# EAGLE board schemat_sterownik_dachu_R129_wersjaD09_Dr_03 (EAGLE 7.5.0)
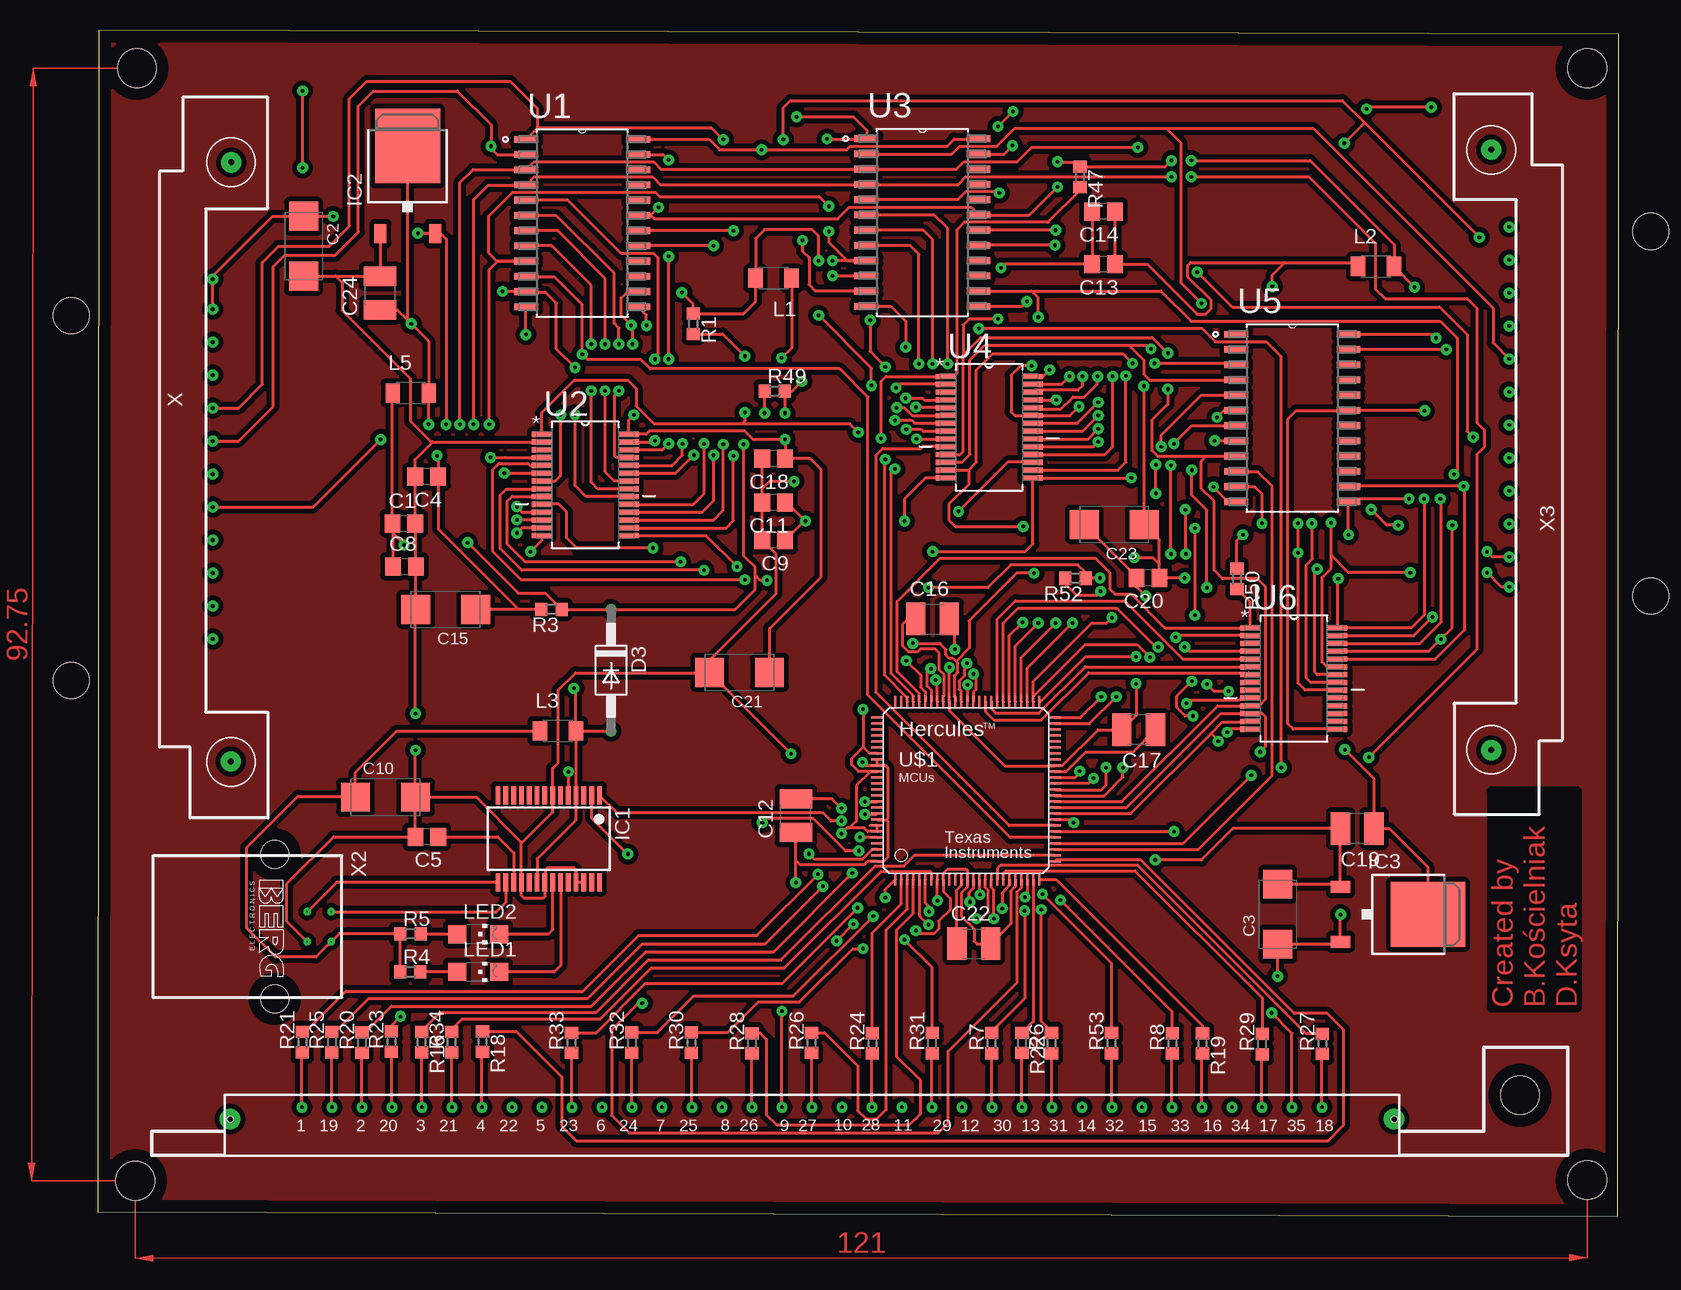
[diagram p1: board, top side]
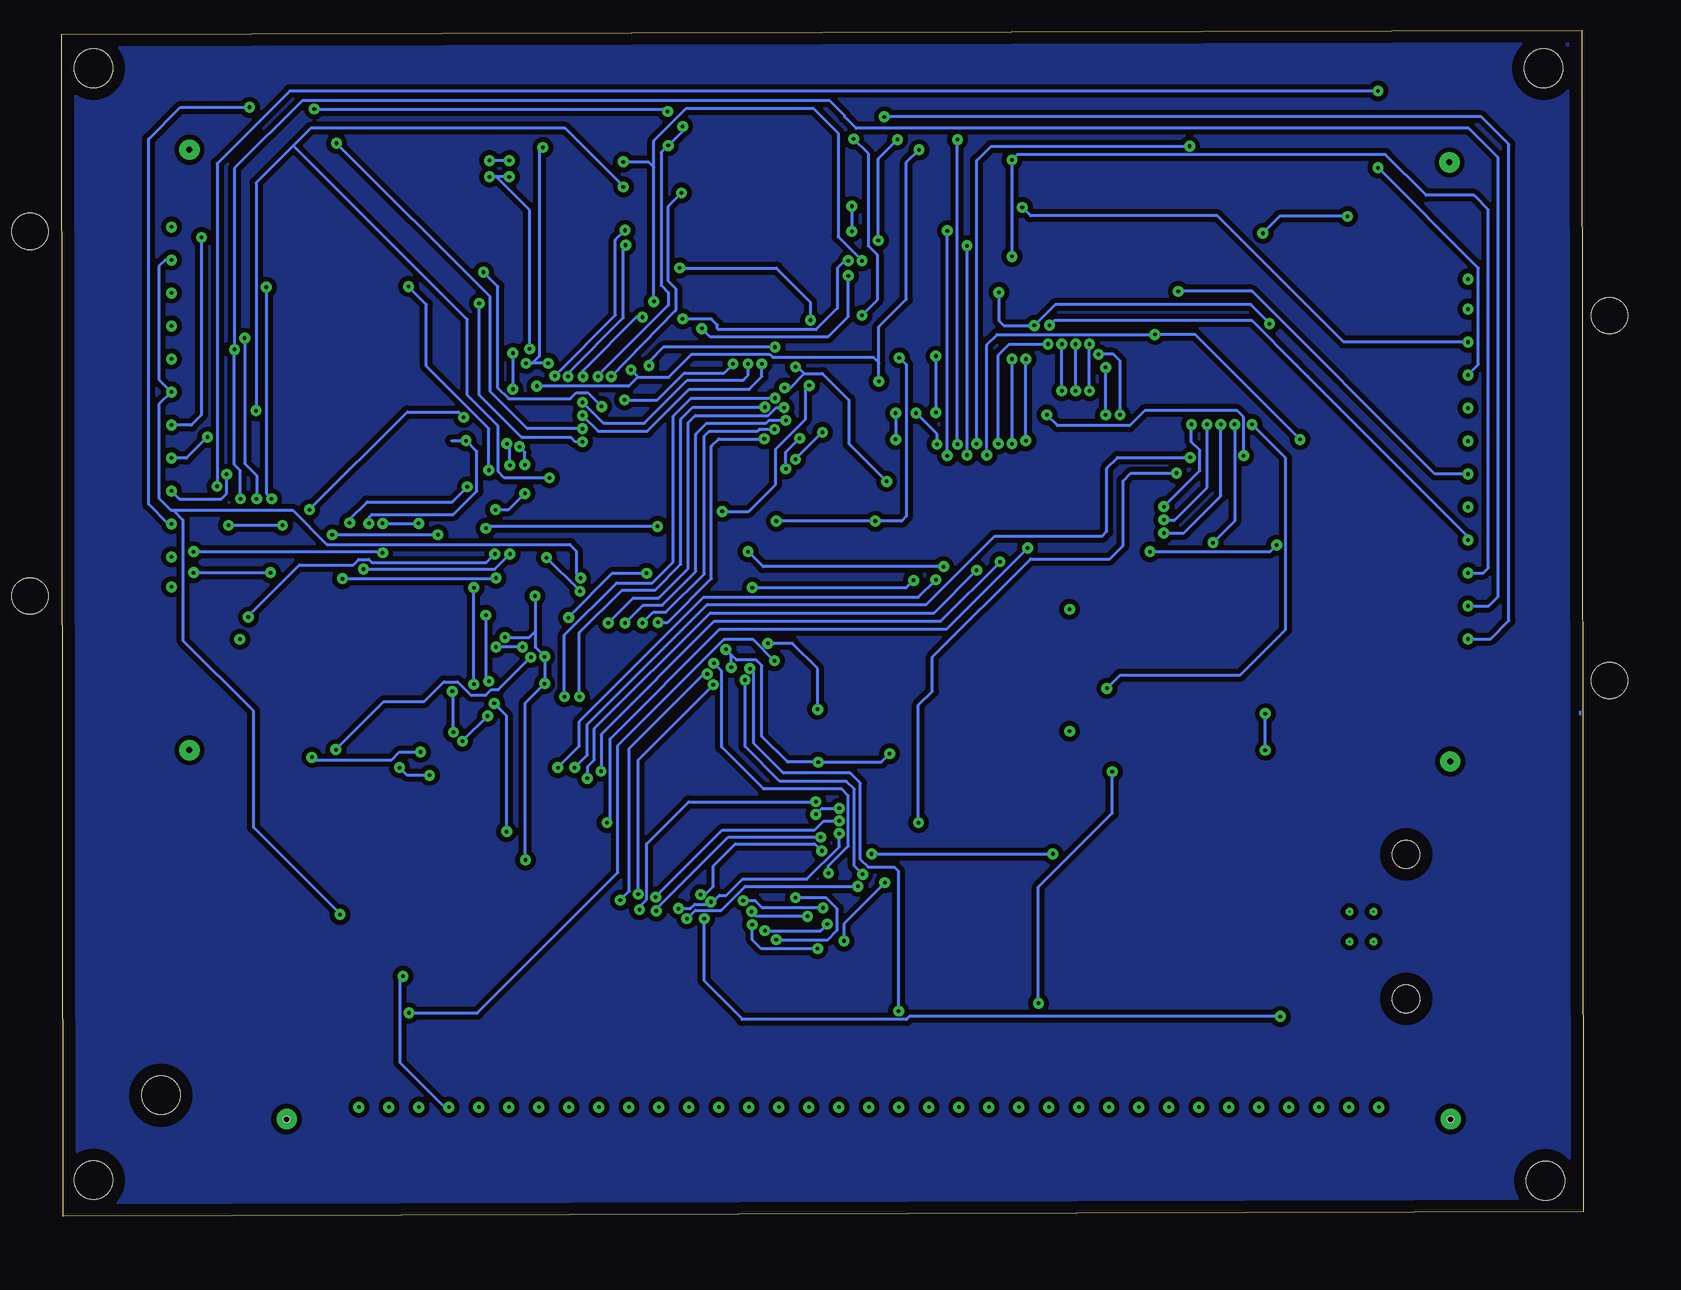
[diagram p2: board, bottom side, seen from below]

Size 126.78 x 98.89 mm. Coordinates in mm from the lower left corner, seen from the top.
Outline: 0,0.35 126.68,0 126.78,98.54 0.1,98.89 0,0.35
Copper layers (1+16): Top 0.035mm / dielectric 1.5mm / Bottom 0.035mm
Design rules "default *": minimum track width 0.2mm, minimum drill 24mil, track to track 8mil, track to pad 8mil, pad to pad 8mil, via to via 8mil, smd to smd 8mil, copper to edge 40mil, drill to drill 8mil, minimum pad ring 10mil, minimum via ring 8mil, stop-mask expansion 4mil, vias tented up to drill 0mil, thermal gap 10mil
Net classes: 0 default: clearance 0.205 mm
Holes 3.2 mm at 3.29,95.7 3.14,2.95 124.14,3 124.14,95.7

## Footprints (pad centres in the part's own frame; a part is rotated, then mirrored left to right if it is on the bottom)
C0805 = smd 1.3 x 1.5: 1 -0.95,0; 2 0.95,0
SMC_C = smd 2.4 x 2.4: + -2.5,0; - 2.5,0
C3225 = smd 1.6 x 2.7: 1 -1.4,0; 2 1.4,0
C1210 = smd 1.6 x 2.7: 1 -1.4,0; 2 1.4,0
DO41-10 = drill 0.3 pad 0.9: A 5.08,0; C -5.08,0
SSOP28 = smd 0.4 x 1.5: 1 -4.225,-3.625; 2 -3.575,-3.625; 3 -2.925,-3.625; 4 -2.275,-3.625; 5 -1.625,-3.625; 6 -0.975,-3.625; 7 -0.325,-3.625; 8 0.325,-3.625; 9 0.975,-3.625; 10 1.625,-3.625; 11 2.275,-3.625; 12 2.925,-3.625; 13 3.575,-3.625; 14 4.225,-3.625; 15 4.225,3.625; 16 3.575,3.625; 17 2.925,3.625; 18 2.275,3.625; 19 1.625,3.625; 20 0.975,3.625; 21 0.325,3.625; 22 -0.325,3.625; 23 -0.975,3.625; 24 -1.625,3.625; 25 -2.275,3.625; 26 -2.925,3.625; 27 -3.575,3.625; 28 -4.225,3.625
TO252 = smd 1 x 1.6: 1 -2.28,-4.8; 2 2.28,-4.8 | smd 5.4 x 6.2: TAB 0,2.5
L3216C = smd 1.2 x 1.6: 1 -1.5,0; 2 1.5,0
CHIPLED_1206 = smd 1.5 x 1.5: A 0,-1.75; C 0,1.75
R0603 = smd 1 x 1.1: 1 -0.85,0; 2 0.85,0
SOIC127P1030X265-24N = smd 1.981 x 0.559: 1 -4.674,6.985; 2 -4.674,5.715; 3 -4.674,4.445; 4 -4.674,3.175; 5 -4.674,1.905; 6 -4.674,0.635; 7 -4.674,-0.635; 8 -4.674,-1.905; 9 -4.674,-3.175; 10 -4.674,-4.445; 11 -4.674,-5.715; 12 -4.674,-6.985; 13 4.674,-6.985; 14 4.674,-5.715; 15 4.674,-4.445; 16 4.674,-3.175; 17 4.674,-1.905; 18 4.674,-0.635; 19 4.674,0.635; 20 4.674,1.905; 21 4.674,3.175; 22 4.674,4.445; 23 4.674,5.715; 24 4.674,6.985
SOP65P780X200-28N = smd 1.651 x 0.432: 1 -3.632,4.216; 2 -3.632,3.581; 3 -3.632,2.921; 4 -3.632,2.286; 5 -3.632,1.626; 6 -3.632,0.965; 7 -3.632,0.33; 8 -3.632,-0.33; 9 -3.632,-0.965; 10 -3.632,-1.626; 11 -3.632,-2.286; 12 -3.632,-2.921; 13 -3.632,-3.581; 14 -3.632,-4.216; 15 3.632,-4.216; 16 3.632,-3.581; 17 3.632,-2.921; 18 3.632,-2.286; 19 3.632,-1.626; 20 3.632,-0.965; 21 3.632,-0.33; 22 3.632,0.33; 23 3.632,0.965; 24 3.632,1.626; 25 3.632,2.286; 26 3.632,2.921; 27 3.632,3.581; 28 3.632,4.216
S-PQFP-G100 = smd 0.17 x 1: P$1 1,-0.5; P$2 1.5,-0.5; P$3 2,-0.5; P$4 2.5,-0.5; P$5 3,-0.5; P$6 3.5,-0.5; P$7 4,-0.5; P$8 4.5,-0.5; P$9 5,-0.5; P$10 5.5,-0.5; P$11 6,-0.5; P$12 6.5,-0.5; P$13 7,-0.5; P$14 7.5,-0.5; P$15 8,-0.5; P$16 8.5,-0.5; P$17 9,-0.5; P$18 9.5,-0.5; P$19 10,-0.5; P$20 10.5,-0.5; P$21 11,-0.5; P$22 11.5,-0.5; P$23 12,-0.5; P$24 12.5,-0.5; P$25 13,-0.5; P$51 13,14.3; P$52 12.5,14.3; P$53 12,14.3; P$54 11.5,14.3; P$55 11,14.3; P$56 10.5,14.3; P$57 10,14.3; P$58 9.5,14.3; P$59 9,14.3; P$60 8.5,14.3; P$61 8,14.3; P$62 7.5,14.3; P$63 7,14.3; P$64 6.5,14.3; P$65 6,14.3; P$66 5.5,14.3; P$67 5,14.3; P$68 4.5,14.3; P$69 4,14.3; P$70 3.5,14.3; P$71 3,14.3; P$72 2.5,14.3; P$73 2,14.3; P$74 1.5,14.3; P$75 1,14.3 | smd 1 x 0.17: P$26 14.3,1; P$27 14.3,1.5; P$28 14.3,2; P$29 14.3,2.5; P$30 14.3,3; P$31 14.3,3.5; P$32 14.3,4; P$33 14.3,4.5; P$34 14.3,5; P$35 14.3,5.5; P$36 14.3,6; P$37 14.3,6.5; P$38 14.3,7; P$39 14.3,7.5; P$40 14.3,8; P$41 14.3,8.5; P$42 14.3,9; P$43 14.3,9.5; P$44 14.3,10; P$45 14.3,10.5; P$46 14.3,11; P$47 14.3,11.5; P$48 14.3,12; P$49 14.3,12.5; P$50 14.3,13; P$76 -0.5,13; P$77 -0.5,12.5; P$78 -0.5,12; P$79 -0.5,11.5; P$80 -0.5,11; P$81 -0.5,10.5; P$82 -0.5,10; P$83 -0.5,9.5; P$84 -0.5,9; P$85 -0.5,8.5; P$86 -0.5,8; P$87 -0.5,7.5; P$88 -0.5,7; P$89 -0.5,6.5; P$90 -0.5,6; P$91 -0.5,5.5; P$92 -0.5,5; P$93 -0.5,4.5; P$94 -0.5,4; P$95 -0.5,3.5; P$96 -0.5,3; P$97 -0.5,2.5; P$98 -0.5,2; P$99 -0.5,1.5; P$100 -0.5,1
5566-12 = drill 0.3 pad 0.9: 1 -11.75,-9.5; 2 -9,-9.5; 3 -6.25,-9.5; 4 -3.5,-9.5; 5 -0.75,-9.5; 6 2,-9.5; 7 4.75,-9.5; 8 7.5,-9.5; 9 10.25,-9.5; 10 13,-9.5; 11 15.75,-9.5; 12 18.25,-9.5 | hole 3: 15.2,2.29; -15.2,2.29
PN61729 = drill 0.1 octagon: 1 1.25,4.71; 2 -1.25,4.71; 3 -1.25,2.71; 4 1.25,2.71 | hole 2.3: -6.02,0; 6.02,0
5566-12' = drill 0.3 pad 0.9: 1 14.44,-9.5; 2 11.94,-9.5; 3 9.19,-9.5; 4 6.44,-9.5; 5 3.69,-9.5; 6 0.94,-9.5; 7 -1.81,-9.5; 8 -4.56,-9.5; 9 -7.31,-9.5; 10 -10.06,-9.5; 11 -12.81,-9.5; 12 -15.56,-9.5 | hole 3: 15.2,2.29; -15.2,2.29
5749069-4 = drill 0.3 pad 0.9: 1 12.59,3.888; 2 17.59,3.888; 3 22.59,3.888; 4 27.59,3.888; 5 32.59,3.888; 6 37.59,3.888; 7 42.59,3.888; 8 47.59,3.888; 9 52.59,3.888; 10 57.59,3.888; 11 62.59,3.888; 12 67.59,3.888; 13 72.59,3.888; 14 77.59,3.888; 15 82.59,3.888; 16 87.59,3.888; 17 92.59,3.888; 18 97.59,3.888; 19 15.09,3.888; 20 20.09,3.888; 21 25.09,3.888; 22 30.09,3.888; 23 35.09,3.888; 24 40.09,3.888; 25 45.09,3.888; 26 50.09,3.888; 27 55.09,3.888; 28 60.09,3.888; 29 65.09,3.888; 30 70.09,3.888; 31 75.09,3.888; 32 80.09,3.888; 33 85.09,3.888; 34 90.09,3.888; 35 95.09,3.888 | hole 3.2: 114.09,4.888 | hole 0.5: 103.61,2.89; 6.61,2.89

## Placement (x,y rotation side)
C1  0.1 uF  [C0805]  25.52,57.76 0 top
C2  10uF  [SMC_C]  17.17,80.87 270 top
C3  10uF  [SMC_C]  98.35,25.19 90 top
C4  0.1 uF  [C0805]  27.42,61.65 180 top
C5  0.1 uF  [C0805]  27.44,31.64 180 top
C8  10 uF  [C0805]  25.57,54.17 0 top
C9  10 uF  [C0805]  56.34,56.35 180 top
C10  33uF  [SMC_C]  23.99,34.94 0 top
C11  0.1 uF  [C0805]  56.34,59.5 180 top
C12  120 uF  [C3225]  58.19,33.39 90 top
C13  10 uF  [C0805]  83.82,79.35 180 top
C14  0.1 uF  [C0805]  83.82,83.76 180 top
C15  10uF  [SMC_C]  29.01,50.59 180 top
C16  120 uF  [C3225]  69.58,49.79 0 top
C17  120 uF  [C3225]  86.76,40.56 180 top
C18  0.1 uF  [C0805]  56.34,63.15 180 top
C19  100uF  [C1210]  104.97,32.32 180 top
C20  0.1 uF  [C0805]  87.54,53.21 180 top
C21  10uF  [SMC_C]  53.5,45.34 180 top
C22  120 uF  [C3225]  73.02,22.72 0 top
C23  10uF  [SMC_C]  84.72,57.67 180 top
C24  100uF  [C1210]  23.55,76.95 90 top
D3  1N4004  [DO41-10]  42.79,45.51 270 top
IC1  FT232RL  [SSOP28]  37.6,31.46 180 top
IC2  LM1117DTX-5.0  [TO252]  25.84,86.71 0 top
IC3  LM1117DTX-3.3  [TO252]  108.37,25.16 270 top
L1  600 Ohm  [L3216C]  56.33,78.19 180 top
L2  600 Ohm  [L3216C]  106.54,79.18 0 top
L3  600 Ohm  [L3216C]  38.36,40.46 0 top
L5  600 Ohm  [L3216C]  26.1,68.63 0 top
LED1  [CHIPLED_1206]  31.71,20.37 270 top
LED2  [CHIPLED_1206]  31.71,23.51 270 top
R1  10 kOhm  [R0603]  49.64,74.4 270 top
R3  12 Ohm  [R0603]  37.82,50.59 180 top
R4  270 Ohm  [R0603]  26.06,20.37 0 top
R5  270 Ohm  [R0603]  26.07,23.54 0 top
R6  10 kOhm  [R0603]  79.49,14.42 90 top
R7  10 kOhm  [R0603]  74.51,14.42 90 top
R8  10 kOhm  [R0603]  89.56,14.41 90 top
R16  4,7 kOhm  [R0603]  27.01,14.51 270 top
R18  4,7 kOhm  [R0603]  32.07,14.57 270 top
R19  10 kOhm  [R0603]  92.08,14.41 270 top
R20  10 kOhm  [R0603]  22.04,14.48 90 top
R21  10 kOhm  [R0603]  17.06,14.5 90 top
R22  10 kOhm  [R0603]  77.04,14.45 270 top
R23  10 kOhm  [R0603]  24.48,14.55 90 top
R24  10 kOhm  [R0603]  64.56,14.41 90 top
R25  10 kOhm  [R0603]  19.52,14.51 90 top
R26  10 kOhm  [R0603]  59.5,14.45 90 top
R27  10 kOhm  [R0603]  102.06,14.37 90 top
R28  10 kOhm  [R0603]  54.54,14.41 90 top
R29  10 kOhm  [R0603]  97.05,14.36 90 top
R30  10 kOhm  [R0603]  49.48,14.47 90 top
R31  10 kOhm  [R0603]  69.55,14.42 90 top
R32  10 kOhm  [R0603]  44.52,14.47 90 top
R33  10 kOhm  [R0603]  39.5,14.45 90 top
R34  10 kOhm  [R0603]  29.51,14.51 90 top
R47  10 kOhm  [R0603]  81.87,86.65 270 top
R49  12 Ohm  [R0603]  56.43,68.78 0 top
R50  10 kOhm  [R0603]  94.95,53.15 270 top
R52  12 Ohm  [R0603]  81.48,53.18 180 top
R53  10 kOhm  [R0603]  84.5,14.42 90 top
U1  TPIC2603DW  [SOIC127P1030X265-24N]  40.39,82.79 0 top
U2  TPIC46L03DB  [SOP65P780X200-28N]  40.64,60.97 0 top
U3  TPIC2603DW  [SOIC127P1030X265-24N]  68.74,82.84 0 top
U4  TPIC46L03DB  [SOP65P780X200-28N]  74.29,65.77 0 top
U5  TPIC2603DW  [SOIC127P1030X265-24N]  99.57,66.54 0 top
U6  TPIC46L03DB  [SOP65P780X200-28N]  99.7,44.82 0 top
U$1  TMS470MF03107  [S-PQFP-G100]  65.48,28.57 0 top
X  5566-12CONECTOR  [5566-12]  0.1,59.87 90 top
X2  [PN61729]  14.76,24.14 270 top
X3  5566-12CONECTOR_Z  [5566-12']  127.14,66.9 270 top
Y1  5749069-45749069-3  [5749069-4]  4.44,5.2 0 top

## Tracks (layer width: path | path; a pad name or v marks a point on that pad's centre or on a via)
3.3V  (via drill 0.3 pad 0.9)
  Top 0.254: U$1.P$20 75.98,27.59 75.39,26.9 v75.39,25.65 | U$1.P$14 72.98,27.34 72.59,26.95 72.59,26.3 v72.69,26.2 | 62.64,32.35 63.89,32.35 64.17,32.07 U$1.P$95 U$1.P$94 64.37,32.57 | 62.64,32.35 62.44,32.35 v61.99,31.9 | U$1.P$85 64.96,37.05 64.39,37.05 63.24,35.9 63.24,32.95 62.64,32.35 | U$1.P$85 64.37,37.07 | v67.94,47.75 70.19,47.75 70.69,47.25 70.69,46.8 70.99,46.5 71.29,46.5 71.54,46.25 | U$1.P$65 71.48,43.26 71.39,43.35 71.39,45.05 71.69,45.35 71.69,46.1 71.54,46.25 | v87.69,46.6 86.64,47.65 82.29,47.65 77.98,43.34 U$1.P$52 77.98,44.59 82.84,49.45 84.09,49.45 v84.54,49.9 | v63.79,42.25 63.79,39.1 | 63.79,39.1 64.29,38.6 64.95,38.6 U$1.P$82 | U$1.P$85 63.42,37.07 62.84,37.65 62.84,38.15 63.79,39.1 | v78.04,53.6 76.59,53.6 72.64,49.65 72.64,47.35 71.54,46.25 | v103.94,38.9 106.34,36.5 106.34,32.35 C19.1 107.62,32.32 110.84,29.1 110.84,25.19 IC3.TAB
  Bottom 0.254: v75.39,25.65 74.39,25.65 74.04,26 72.89,26 v72.69,26.2 72.49,26.2 71.99,26.75 71.39,26.75 70.04,28.1 64.69,28.1 61.99,30.8 v61.99,31.9 | v63.79,42.25 63.79,45.65 65.89,47.75 v67.94,47.75 | v87.69,46.6 90.39,43.9 90.99,43.9 91.44,43.45 92.69,43.45 93.79,44.55 94.94,44.55 96.59,42.9 99.94,42.9 v103.94,38.9 | v84.54,49.9 84.54,49.95 80.89,53.6 v78.04,53.6
5V  (via drill 0.3 pad 0.9)
  Top 0.254: IC1.20 36.62,28.59 36.64,28.6 36.64,29.8 39.84,33 39.84,35.05 IC1.4 39.88,40.45 L3.2 | L3.2 42.76,40.46 D3.A | IC2.TAB 25.79,88.6 25.79,74.75 | 25.79,74.75 24.99,75.55 C24.1 | 25.79,74.75 v26.14,74.4 27.59,72.95 L5.2 v27.59,66 | L3.2 39.86,43.83 v39.69,44 | v48.69,77 49.64,76.05 R1.1 53.84,75.25 54.84,76.25 L1.2 54.84,81.5 55.59,82.25 59.54,82.25 60.09,81.7 v60.09,79.65 | v45.74,74.25 45.74,75.13 U1.13 | U3.13 77.05,75.86 v77.44,76.25 | v79.99,87.9 80.01,87.88 81.49,87.88 R47.1 88.99,87.5 v89.49,88 | v91.14,88 101.04,88 108.04,81 L2.2 108.04,79.15 v109.74,77.45 | R50.1 94.95,56.31 v95.44,56.8 | v104.24,56.8 U5.13 104.49,59.8 v109.29,59.8
  Bottom 0.254: v39.69,44 38.59,45.1 28.59,45.1 24.79,48.9 24.79,63.2 v27.59,66 | v48.69,77 48.69,74.65 48.29,74.25 v45.74,74.25 43.99,76 27.69,76 26.14,74.45 v26.14,74.4 | v77.44,76.25 77.44,87.45 | 77.44,87.45 77.44,89.65 74.74,92.35 64.14,92.35 62.09,90.3 62.09,81.65 v60.09,79.65 | v79.99,87.9 77.89,87.9 77.44,87.45 | v89.49,88 v91.14,88 | v95.44,56.8 v104.24,56.8 | v109.74,77.45 109.74,60.25 v109.29,59.8
ADIN[2]
  Top 0.254: U$1.P$71 68.48,43.56 66.64,45.4 66.64,51.25 70.24,54.85 83.14,54.85 84.34,53.65 84.34,52.3 84.79,51.85 86.14,51.85 88.94,49.05 96.05,49.05 U6.1 96.07,51.18 R50.2
ADIN[3]  (via drill 0.3 pad 0.9)
  Top 0.254: U$1.P$72 67.98,43.41 66.14,45.25 66.14,62 v66.44,62.3 | v65.29,64.85 65.29,69.6 65.69,70 70.64,70 U4.1 71.34,70 71.59,70.25 71.59,82.2 72.24,82.85 79.19,82.85 81.87,85.53 R47.2
  Bottom 0.254: v66.44,62.3 66.44,63.7 v65.29,64.85
ADIN[4]  (via drill 0.3 pad 0.9)
  Top 0.254: U$1.P$73 67.48,43.26 67.43,43.26 65.59,45.1 65.59,63.05 v65.64,63.1 | v63.39,65.35 62.69,66.05 53.69,66.05 | 37.02,65.2 U2.1 36.99,65.2 36.99,66.95 39.74,69.7 44.19,69.7 44.89,69 44.89,67.55 46.39,66.05 53.69,66.05 | R1.2 52.09,73.55 v53.94,71.7 | v53.94,67 53.94,66.3 53.69,66.05
  Bottom 0.254: v65.64,63.1 v63.39,65.35 | v53.94,71.7 v53.94,67
CAN2SRX  (via drill 0.3 pad 0.9)
  Top 0.254: U$1.P$38 79.8,35.55 83.64,35.55 84.04,35.95 v84.04,37.4 | v32.74,63.25 33.95,63.26 U2.4
  Bottom 0.254: v84.04,37.4 82.99,38.45 82.99,41 72.99,51 54.74,51 49.04,56.7 40.09,56.7 39.69,57.1 39.69,62.35 38.79,63.25 v32.74,63.25
CAN2STX  (via drill 0.3 pad 0.9)
  Top 0.254: U$1.P$37 79.8,35.05 83.89,35.05 85.44,36.6 v85.44,37.4 | v53.94,53.05 35.29,53.05 32.94,55.4 32.94,62.25 33.44,62.75 35.89,62.75 36.04,62.6 U2.5
  Bottom 0.254: v85.44,37.4 83.64,39.2 83.64,41.25 73.29,51.6 55.39,51.6 v53.94,53.05
GATE0  (via drill 0.3 pad 0.9)
  Top 0.254: U2.27 46.34,64.55 v46.44,64.65 | U1.5 39.19,84.7 43.64,80.25 46.34,80.25 46.74,79.85 46.74,71.95 46.44,71.65 v46.44,71.45
  Bottom 0.254: v46.44,64.65 v46.44,71.45
GATE1  (via drill 0.3 pad 0.9)
  Top 0.254: U2.25 43.23,63.26 43.09,63.4 43.09,68.45 v43.44,68.8 | v43.44,72.7 43.44,74.05 43.04,74.45 43.04,78.6 38.24,83.4 35.74,83.4 U1.6
  Bottom 0.254: v43.44,68.8 v43.44,72.7
GATE2  (via drill 0.3 pad 0.9)
  Top 0.254: U2.22 43.04,61.3 42.29,62.05 v42.29,68.8 | v42.29,72.7 42.29,78.15 38.34,82.15 U1.7
  Bottom 0.254: v42.29,68.8 v42.29,72.7
GATE3  (via drill 0.3 pad 0.9)
  Top 0.254: U2.21 41.7,60.64 41.14,61.2 v41.14,68.8 | v41.14,72.7 41.14,77.6 37.84,80.9 35.73,80.9 U1.8
  Bottom 0.254: v41.14,68.8 v41.14,72.7
GATE4  (via drill 0.3 pad 0.9)
  Top 0.254: U2.18 50.37,58.68 51.34,59.65 v51.34,63.45 | v51.34,80.9 45.08,80.9 U1.17
  Bottom 0.254: v51.34,63.45 v51.34,80.9
GATE5  (via drill 0.3 pad 0.9)
  Top 0.254: U2.16 52.38,57.39 52.99,58 v52.99,63.4 | v52.99,82.15 U1.18
  Bottom 0.254: v52.99,63.4 v52.99,82.15
GATE6  (via drill 0.3 pad 0.9)
  Top 0.254: v75.14,85.3 75.04,85.4 72.34,85.4 71.69,84.75 U3.5 | U4.27 80.34,69.35 v80.99,70
  Bottom 0.254: v80.99,70 75.64,75.5 75.59,75.55 75.59,77.3 76.24,77.95 76.24,84.2 v75.14,85.3
GATE7  (via drill 0.3 pad 0.9)
  Top 0.254: U4.25 v79.88,68.06 v79.89,68.05 | v70.84,71.05 70.84,82.35 69.74,83.45 64.09,83.45 U3.6
  Bottom 0.254: v79.89,68.05 77.14,68.05 74.89,70.3 71.59,70.3 v70.84,71.05
GATE8  (via drill 0.3 pad 0.9)
  Top 0.254: U4.22 81.64,66.1 v83.39,67.85 | v69.59,71.05 69.59,81.4 68.79,82.2 U3.7
  Bottom 0.254: v83.39,67.85 81.64,66.1 78.24,66.1 74.64,69.7 69.99,69.7 69.59,70.1 v69.59,71.05
GATE9  (via drill 0.3 pad 0.9)
  Top 0.254: U4.21 82.08,65.44 v83.39,66.75 | v68.44,71.05 68.44,80.2 67.74,80.9 64.1,80.9 U3.8
  Bottom 0.254: v83.39,66.75 82.09,65.45 77.99,65.45 74.49,68.95 69.49,68.95 68.44,70 v68.44,71.05
GATE10  (via drill 0.3 pad 0.9)
  Top 0.254: U4.18 83.92,63.48 84.59,64.15 v84.59,70 | v79.79,80.95 73.43,80.95 U3.17
  Bottom 0.254: v79.79,80.95 79.99,80.75 79.99,74.9 84.59,70.3 v84.59,70
GATE11  (via drill 0.3 pad 0.9)
  Top 0.254: U4.16 85.03,62.19 85.69,62.85 v85.69,70.05 | v79.84,82.2 U3.18
  Bottom 0.254: v85.69,70.05 80.64,75.1 80.64,81.4 v79.84,82.2
GATE12  (via drill 0.3 pad 0.9)
  Top 0.254: U6.27 109.69,48.4 v111.24,49.95 | v88.19,60.25 v88.19,62.65 | v88.64,64.15 88.64,65.1 91.99,68.45 U5.5 | v90.69,55.2 90.69,58.85 v90.64,58.9
  Bottom 0.254: v90.64,58.9 89.54,58.9 v88.19,60.25 | v88.19,62.65 88.19,63.7 v88.64,64.15 | v111.24,49.95 111.24,50.05 106.99,54.3 102.49,54.3 102.04,54.75 101.19,54.75 100.94,54.5 91.39,54.5 v90.69,55.2
GATE13  (via drill 0.3 pad 0.9)
  Top 0.254: U6.25 110.95,47.11 v111.94,48.1 112.89,49.05 v112.89,57.6 | v108.39,57.6 107.44,57.6 v106.14,58.9 | v93.29,66.6 93.89,67.2 94.87,67.2 U5.6
  Bottom 0.254: v106.14,58.9 97.99,67.05 93.74,67.05 v93.29,66.6 | v112.89,57.6 v108.39,57.6
GATE14  (via drill 0.3 pad 0.9)
  Top 0.254: U6.22 101.64,45.15 101.44,45.35 101.44,53.75 v101.64,53.95 | v89.44,55.2 v89.44,62.6 | v89.69,64.4 91.19,65.9 U5.7
  Bottom 0.254: v101.64,53.95 90.69,53.95 v89.44,55.2 | v89.44,62.6 89.44,64.15 v89.69,64.4
GATE15  (via drill 0.3 pad 0.9)
  Top 0.254: U6.21 101.1,44.49 100.74,44.85 100.74,54.3 101.24,54.8 101.24,57.7 v101.19,57.75 | v93.09,64.65 94.88,64.65 U5.8
  Bottom 0.254: v101.19,57.75 101.19,58.25 100.94,58.5 94.14,58.5 92.19,60.45 92.19,63.75 v93.09,64.65 94.29,64.65
GIOA[6]  (via drill 0.3 pad 0.9)
  Top 0.254: U$1.P$15 73.48,26.86 v73.54,26.8 | v63.44,30.45 62.34,30.45 59.64,33.15 55.74,33.15 v55.39,32.8 | v33.89,61.95 36.99,61.95 U2.6
  Bottom 0.254: v73.54,26.8 73.19,26.8 72.49,27.5 72.49,29.2 70.64,31.05 64.04,31.05 v63.44,30.45 | v55.39,32.8 55.39,42.6 54.24,43.75 54.24,46.6 46.04,54.8 39.44,54.8 38.34,55.9 38.34,61.3 37.69,61.95 v33.89,61.95
GND  (via drill 0.3 pad 0.9)
  Top 0.254: IC1.26 IC1.25 39.88,28.87 39.69,29.05 37.49,29.05 37.29,28.85 37.29,27.85 IC1.21 37.27,26.63 37.14,26.5 35.54,26.5 35.29,26.75 35.29,27.8 IC1.18 35.32,31.16 | C22.2 74.42,23.37 | U$1.P$21 76.48,27.49 76.09,27.1 76.09,24.39 C22.2 | C22.2 74.4,22.7 73.29,22.7 73.04,22.95 73.04,23.95 71.99,25 71.99,26.95 72.49,27.45 U$1.P$13 72.49,28.85 72.39,28.95 70.84,28.95 70.48,28.59 U$1.P$9 70.48,27.06 71.04,26.5 71.04,25.55 70.09,24.6 70.09,23.95 69.69,23.55 68.44,23.55 v68.19,23.8 | v62.99,24.35 v61.59,22.95 | v58.19,27.8 58.19,29.65 | 58.19,29.65 C12.1 | 58.19,29.65 58.54,29.3 63.89,29.3 64.16,29.57 U$1.P$100 65.51,29.57 65.89,29.95 65.89,32.9 65.74,33.05 | U$1.P$83 U$1.P$84 65.67,37.57 65.69,37.55 | U$1.P$93 65,33.05 65.74,33.05 | 65.74,33.05 65.89,33.2 65.89,37.35 65.69,37.55 | v70.99,45.75 U$1.P$66 70.98,42.16 75.59,37.55 79.76,37.55 U$1.P$42 80.41,37.57 83.39,40.55 C17.2 86.54,41.74 v86.54,44.4 | v71.44,47.25 71.44,49.33 C16.2 | U$1.P$51 78.56,42.87 82.34,46.65 v86.54,46.65 | 65.69,37.55 64.04,37.55 v63.74,37.85 | v57.79,38.55 C21.- | C3.- 103.32,27.69 IC3.1 C19.2 94.61,32.32 91.99,29.7 v88.14,29.7 | X2.4 15.74,24.62 15.74,27.7 19.68,31.64 C5.2 26.49,34.45 | 26.49,34.45 C10.- v26.49,38.85 | 35.32,31.16 31.59,34.9 26.94,34.9 26.49,34.45 | 35.32,31.16 35.41,31.16 37.94,33.7 IC1.7 37.92,37.34 38.39,37.8 38.39,43.85 39.84,45.3 50.96,45.3 C21.- | C21.- 51,46.36 56.54,51.9 56.54,55.2 C9.2 C11.2 55.39,60.65 | 55.39,60.65 C18.2 | v26.49,41.9 26.49,50.57 C15.- C8.2 26.52,57.71 C1.2 | C1.2 C4.2 | C1.2 26.47,63.08 27.94,64.55 | 27.94,64.55 U2.2 | 23.57,78.32 C24.2 | C2.- 19.84,78.37
  Top 0.254: 19.84,78.37 23.53,78.37 C24.2 | IC2.1 C24.2 | 27.94,64.55 27.79,64.55 26.09,66.25 26.09,69.8 20.39,75.5 20.39,77.82 19.84,78.37 | U4.2 66.84,69.35 v66.54,69.05 | v58.04,61.25 55.99,61.25 55.39,60.65 | C14.2 C13.2 75.59,79.35 v75.29,79.05 | v64.39,74.7 64.39,72.1 v65.64,70.8 | C23.- 86.59,53.3 C20.2 86.59,52.45 v87.34,51.7 | U6.2 89.99,48.4 v89.84,48.25
  Bottom 0.254: v68.19,23.8 63.54,23.8 v62.99,24.35 | v61.59,22.95 61.59,24.4 v58.19,27.8 | v70.99,45.75 70.99,46.8 | 70.99,46.8 v71.44,47.25 | 70.99,46.8 70.54,46.35 68.89,46.35 68.44,45.9 68.44,40 66.29,37.85 v63.74,37.85 58.49,37.85 v57.79,38.55 | v26.49,38.85 v26.49,41.9 | v66.54,69.05 66.09,69.05 64.89,70.25 | 64.89,70.25 63.39,70.25 61.19,68.05 61.19,64.4 v58.04,61.25 | v75.29,79.05 67.24,79.05 64.39,76.2 v64.39,74.7 | v65.64,70.8 65.44,70.8 64.89,70.25 | v87.34,51.7 87.34,48.75 | 87.34,48.75 87.34,47.45 v86.54,46.65 v86.54,44.4 88.14,42.8 v88.14,29.7 | v89.84,48.25 87.84,48.25 87.34,48.75
HET[0]  (via drill 0.3 pad 0.9)
  Top 0.254: v50.54,53.85 35.34,53.85 33.54,55.65 33.54,60.1 34.04,60.6 36.97,60.6 U2.8 | U$1.P$39 79.81,36.1 82.64,36.1 82.99,36.45 v82.99,36.5
  Bottom 0.254: v50.54,53.85 54.09,50.3 72.74,50.3 82.39,40.65 82.39,38.05 82.94,37.5 82.94,36.55 v82.99,36.5
HET[1]  (via drill 0.3 pad 0.9)
  Top 0.254: U$1.P$40 81.47,36.57 81.84,36.94 v81.84,37.1 | v48.59,54.55 35.64,54.55 34.14,56.05 34.14,59.6 34.54,60 U2.9
  Bottom 0.254: v48.59,54.55 53.54,49.6 72.39,49.6 81.84,40.15 v81.84,37.1
HET[2]  (via drill 0.3 pad 0.9)
  Top 0.254: U$1.P$49 82.66,41.07 v84.89,43.3 | v67.34,68.2 68.74,68.2 68.89,68.05 U4.4
  Bottom 0.254: v67.34,68.2 74.34,68.2 75.84,66.7 75.84,54.55 77.59,52.8 80.54,52.8 84.89,48.45 v84.89,43.3
HET[3]  (via drill 0.3 pad 0.9)
  Top 0.254: U$1.P$50 81.91,41.57 v83.64,43.3 | U4.5 70.6,67.45 v68.19,67.45
  Bottom 0.254: v68.19,67.45 74.19,67.45 75.19,66.45 75.19,54.35 77.34,52.2 80.09,52.2 83.64,48.65 v83.64,43.3
HET[4]  (via drill 0.3 pad 0.9)
  Top 0.254: U$1.P$53 77.48,45.69 v81.24,49.45 | v66.59,67.4 67.24,67.4 67.89,66.75 70.64,66.75 U4.6
  Bottom 0.254: v81.24,49.45 79.14,51.55 77.04,51.55 74.59,54 74.59,66.15 73.99,66.75 67.89,66.75 67.24,67.4 v66.59,67.4
HET[5]  (via drill 0.3 pad 0.9)
  Top 0.254: U$1.P$54 76.98,46.59 v79.84,49.45 | v66.44,66.35 67.84,66.35 68.09,66.1 U4.7 | U4.7
  Bottom 0.254: v79.84,49.45 78.34,50.95 76.74,50.95 73.94,53.75 73.94,65.2 73.04,66.1 68.09,66.1 67.84,66.35 v66.44,66.35
HET[6]  (via drill 0.3 pad 0.9)
  Top 0.254: U$1.P$55 76.48,47.54 v78.39,49.45 | v67.39,65.6 68.64,65.6 68.79,65.45 70.65,65.45 U4.8
  Bottom 0.254: v78.39,49.45 77.49,50.35 76.44,50.35 73.24,53.55 73.24,65.05 72.84,65.45 68.79,65.45 68.64,65.6 v67.39,65.6
HET[7]  (via drill 0.3 pad 0.9)
  Top 0.254: U$1.P$56 75.98,48.39 v77.09,49.5 | v68.24,64.8 U4.9
  Bottom 0.254: v77.09,49.5 76.29,49.5 72.64,53.15 72.64,64.2 72.04,64.8 v68.24,64.8
HET[8]  (via drill 0.3 pad 0.9)
  Top 0.254: U$1.P$57 75.48,49.44 76.74,50.7 84.94,50.7 88.19,47.45 v88.39,47.45 | v90.59,47.45 90.94,47.1 U6.4
  Bottom 0.254: v88.39,47.45 v90.59,47.45
HET[9]
  Top 0.254: U$1.P$58 74.98,49.79 76.49,51.3 85.59,51.3 90.44,46.45 U6.5
HET[10]
  Top 0.254: U$1.P$59 74.48,42.31 74.84,41.95 78.44,41.95 82.29,45.8 96.05,45.8 U6.6
HET[11]
  Top 0.254: U$1.P$60 73.98,42.06 74.69,41.35 78.64,41.35 82.59,45.3 95.92,45.3 U6.7 | 96.02,45.2 U6.7 | U6.7
HET[13]  (via drill 0.3 pad 0.9)
  Top 0.254: R8.2 89.56,17.03 v80.24,26.35 | U$1.P$62 72.99,43.7 73.19,43.9 73.19,45 v72.99,45.2
  Bottom 0.254: v80.24,26.35 79.49,27.1 79.49,39 73.29,45.2 v72.99,45.2
HET[14]  (via drill 0.3 pad 0.9)
  Top 0.254: R53.2 84.5,21.09 v78.74,26.85 | v72.49,44.3 U$1.P$63
  Bottom 0.254: v78.74,26.85 78.74,38.05 v72.49,44.3
MIBSPI1CLK  (via drill 0.3 pad 0.9)
  Top 0.254: U$1.P$34 86.11,33.57 92.79,40.25 | 92.79,40.25 93.74,41.2 96.03,41.2 U6.13 | v30.19,66 30.19,86.15 31.29,87.25 35.7,87.25 U1.3 36.33,87.85 46.39,87.85 46.94,87.3 64.05,87.3 U3.3 71.58,87.29 72.19,87.9 76.64,87.9 77.84,89.1 v86.69,89.1 | U2.13 35.38,57.39 v34.94,56.95 | U4.13 72.58,62.19 | 72.58,62.19 73.24,62.85 73.24,70.55 74.59,71.9 85.44,71.9 v86.24,71.1 | v88.09,71.1 94.78,71.1 U5.3 | 72.58,62.19 72.58,60.99 70.94,59.35 70.94,58.05 71.49,57.5 v77.14,57.5 | v91.44,57.35 v91.44,50.1 | v91.19,44.6 89.94,43.35 89.94,42.4 90.64,41.7 v91.29,41.7 | v93.39,39.6 93.39,39.65 92.79,40.25
  Bottom 0.254: v30.19,66 30.19,60.05 33.29,56.95 v34.94,56.95 | v86.24,71.1 87.59,71.1 | 87.59,71.1 v88.09,71.1 | v86.69,89.1 86.99,88.8 86.99,71.7 87.59,71.1 | v77.14,57.5 91.29,57.5 v91.44,57.35 | v91.44,50.1 91.44,44.85 v91.19,44.6 | v91.29,41.7 v93.39,39.6
MIBSPI1SCS[0]  (via drill 0.3 pad 0.9)
  Top 0.254: U$1.P$33 81.07,33.07 v81.34,32.8 | v46.29,55.7 39.94,55.7 39.09,56.55 39.09,58.7 38.44,59.35 U2.10
  Bottom 0.254: v81.34,32.8 81.34,32.85 81.09,33.1 81.09,39.8 71.94,48.95 53.04,48.95 v46.29,55.7
MIBSPI1SCS[1]
  Top 0.254: U$1.P$32 75.97,32.57 64.84,43.7 64.84,63.4 65.44,64 68.59,64 68.74,64.15 U4.10
MIBSPI1SCS[2]  (via drill 0.3 pad 0.9)
  Top 0.254: U$1.P$31 v89.71,32.07 | U6.10 95.29,43.2 95.09,43 90.99,43 v90.74,42.75
  Bottom 0.254: v90.74,42.75 90.36,42.38 89.96,41.97 89.71,41.72 v89.71,32.07
MIBSPI1SCS[3]  (via drill 0.3 pad 0.9)
  Top 0.254: U1.10 35.76,78.3 38.09,78.3 40.39,76 v40.39,71.85 40.79,71.45 45.24,71.45 46.04,70.65 61.84,70.65 64.19,68.3 64.19,43.45 76.07,31.57 U$1.P$30 | U2.7 38.14,61.3 38.59,61.75 v38.59,66.8
  Bottom 0.254: v38.59,66.8 38.59,71.3 39.14,71.85 v40.39,71.85
MIBSPI1SCS[4]  (via drill 0.3 pad 0.9)
  Top 0.254: U$1.P$29 90.46,31.07 v96.14,36.75 | v98.64,37.4 98.64,71.65 97.39,72.9 93.14,72.9 92.04,74 v73.44,74 | v61.24,78.4 U3.10
  Bottom 0.254: v96.14,36.75 97.99,36.75 v98.64,37.4 | v61.24,78.4 61.24,75 62.94,73.3 72.74,73.3 v73.44,74
MIBSPI1SCS[5]
  Top 0.254: U$1.P$28 91.71,30.57 97.89,36.75 97.89,60.85 96.69,62.05 94.94,62.05 U5.10
MIBSPI1SIMO  (via drill 0.3 pad 0.9)
  Top 0.254: U$1.P$35 85.76,34.07 93.59,41.9 U6.12 97.04,41.9 97.34,41.6 97.34,39.15 v96.89,38.7 | U2.12 35.54,58.05 v34.94,58.05 | v31.34,66 31.34,84.75 32.54,85.95 35.7,85.95 U1.4 36.35,86.6 46.29,86.6 46.89,86 64.05,86 U3.4 71.7,86.02 72.34,86.65 v89.49,86.65 | U4.12 72.04,62.85 72.69,63.5 72.69,71.35 73.94,72.6 85.94,72.6 | U5.4 94.88,69.7 87.69,69.7 87.19,70.2 87.19,71.35 85.94,72.6 | v91.14,86.65 100.94,86.65 106.49,81.1 106.49,77.3 107.29,76.5 114.14,76.5 114.94,75.7 114.94,66.15 115.54,65.55 115.54,64.1 114.94,63.5 114.94,47.25 v105.94,38.25 | 85.94,72.6 87.49,72.6 v87.79,72.3
  Bottom 0.254: v31.34,66 31.34,60.75 34.04,58.05 v34.94,58.05 | v105.94,38.25 105.74,38.05 99.29,38.05 98.64,38.7 v96.89,38.7 | v89.49,86.65 90.59,86.65 | 90.59,86.65 v91.14,86.65 | 90.59,86.65 87.79,83.85 v87.79,72.3
MIBSPI1SOMI  (via drill 0.3 pad 0.9)
  Top 0.254: U$1.P$36 85.36,34.57 93.34,42.55 96.05,42.55 | 96.05,42.55 U6.11 | v32.64,66 32.64,78.9 33.34,79.6 35.7,79.6 U1.9 33.27,79.62 32.59,80.3 32.59,83.35 34.59,85.35 46.49,85.35 46.84,85 60.14,85 v60.94,84.2 | v34.94,59.15 35.39,58.7 36.99,58.7 U2.11 | v60.94,82.1 60.94,81.2 62.49,79.65 64.05,79.65 U3.9 61.26,79.67 v61.24,79.65 | U4.11 71.87,63.48 72.14,63.75 72.14,71.8 | 94.86,63.4 U5.9 94.88,63.35 92.39,63.35 | 72.14,71.8 73.59,73.25 87.89,73.25 v89.19,71.95 | 92.39,63.35 88.34,63.35 87.84,63.85 87.84,66.35 89.19,67.7 v89.19,68.95 | v75.04,74.8 72.64,74.8 72.14,74.3 72.14,71.8 | 96.05,42.55 96.79,42.55 97.34,43.1 97.34,52.45 96.64,53.15 93.74,53.15 93.04,53.85 93.04,59.6 91.99,60.65 91.99,62.95 92.39,63.35
  Bottom 0.254: v34.94,59.15 31.94,62.15 31.94,63.85 32.64,64.55 v32.64,66 | v60.94,84.2 v60.94,82.1 | v89.19,71.95 v89.19,68.95 | v61.24,79.65 61.54,79.65 62.14,79.05 62.14,75.7 63.94,73.9 72.04,73.9 72.14,74 72.14,74.3 72.64,74.8 v75.04,74.8 74.49,74.8
N$1  (via drill 0.3 pad 0.9)
  Top 0.254: R7.2 74.51,15.42 77.29,18.2 77.29,25.4 v77.24,25.45 | v63.54,31.6 64.95,31.6 U$1.P$96
  Bottom 0.254: v77.24,25.45 77.24,25.6 71.24,31.6 v63.54,31.6
N$3
  pour Top (isolate 0.406): 0.09,98.65 126.06,98.65 arc-90 126.69,98.02 126.69,0 0.72,0 arc-90 0.09,0.64
N$4
  Top 0.254: U$1.P$67 70.48,43.39 70.54,43.45 70.54,45.15 70.14,45.55 70.14,46.95 69.79,47.3 68.59,47.3 68.34,47.05 67.59,47.05 67.09,47.55 67.09,49.35 67.53,49.79 C16.1
N$5
  Top 0.254: 88.14,40.54 C17.1 86.3,38.7 82.34,38.7 80.71,37.07 U$1.P$41
N$6
  pour Bottom (isolate 0.406): 0.09,98.65 126.37,98.65 arc-90 126.69,98.33 126.69,0 0.41,0 arc-90 0.09,0.32
N$7  (via drill 0.3 pad 0.9)
  Top 0.254: R6.2 79.49,15.4 78.64,16.25 v78.64,25.55 | v63.94,34.55 64.96,34.55 U$1.P$90
  Bottom 0.254: v78.64,25.55 78.64,25.9 78.54,25.9 78.04,26.4 78.04,31.05 74.54,34.55 v63.94,34.55
N$8
  Top 0.254: U$1.P$3 67.49,25.6 65.74,23.85 65.74,8.9 64.94,8.1 64.04,8.1 63.34,8.8 63.34,12.55 60.59,15.3 R26.2
N$9  (via drill 0.3 pad 0.9)
  Top 0.254: R20.2 22.32,15.33 24.49,17.5 41.14,17.5 45.69,22.05 56.34,22.05 v62.89,28.6 | U$1.P$64 71.98,43.76 71.79,43.95 71.79,44.6 72.24,45.05 72.24,45.9 v72.44,46.1
  Bottom 0.254: v62.89,28.6 62.89,29.2 61.24,30.85 61.24,35.05 61.79,35.6 68.29,35.6 71.79,39.1 71.79,45.45 v72.44,46.1
N$10  (via drill 0.3 pad 0.9)
  Top 0.254: R21.2 17.29,15.35 20.69,18.75 40.44,18.75 45.09,23.4 54.94,23.4 v60.04,28.5 | U$1.P$68 69.99,44.55 v69.84,44.7
  Bottom 0.254: v60.04,28.5 60.74,29.2 60.74,35.6 61.39,36.25 66.94,36.25 69.84,39.15 v69.84,44.7
N$11
  Top 0.254: R18.1 34.87,15.42 38.69,11.6 38.69,7.5 39.89,6.3 102.54,6.3 103.84,7.6 103.84,15.55 102.49,16.9 99.74,16.9 86.94,29.7 79.91,29.7 U$1.P$26
N$12  (via drill 0.5 pad 1.68)
  other vias: 11.14,87.85
N$13
  Top 0.254: C5.1 33.35,31.64 34.69,30.3 34.69,27.85 IC1.17
N$14
  Top 0.254: IC1.22 37.94,23.9 37.54,23.5 LED2.C
N$15
  Top 0.254: 71.98,23.08 C22.1 71.54,22.8 71.54,27.15 71.98,27.59 U$1.P$12
N$16  (via drill 0.3 pad 0.9)
  Top 0.254: v61.99,34 61.2,34.79 C12.2 | v63.94,33.5 64.91,33.5 U$1.P$92
  Bottom 0.254: v63.94,33.5 63.44,34 v61.99,34
N$17  (via drill 0.5 pad 1.68)
  other vias: 11.09,37.9
N$18  (via drill 0.5 pad 1.68)
  other vias: 14.74,30.15
N$19  (via drill 0.5 pad 1.68)
  other vias: 14.74,18.15
N$20  (via drill 0.5 pad 1.68)
  other vias: 108.04,8.1
N$21
  Top 0.254: X2.2 33.23,25.39 34.04,26.2 IC1.16
N$22
  Top 0.254: IC1.15 19.91,27.84 X2.3
N$23  (via drill 0.5 pad 1.68)
  other vias: 11.04,8.1
N$24  (via drill 0.5 pad 1.68)
  other vias: 116.14,38.85
N$25  (via drill 0.5 pad 1.68)
  other vias: 116.14,88.9
N$26
  Top 0.254: IC1.23 38.59,20.9 38.04,20.35 33.48,20.35 LED1.C
N$27  (via drill 0.3 pad 0.9)
  Top 0.254: C8.1 24.62,56.9 | 24.62,56.9 24.62,57.71 C1.1 24.57,68.6 L5.1 | U2.14 37.01,56.32 v36.09,55.4 | v25.54,55.95 25.54,55.98 24.62,56.9
  Bottom 0.254: v36.09,55.4 26.09,55.4 v25.54,55.95
N$28
  Top 0.254: LED1.A R4.2
N$29
  Top 0.254: LED2.A 26.95,23.51 R5.2
N$36
  Top 0.254: R16.1 27.01,15.47 28.54,17 41.54,17 45.89,21.35 56.94,21.35 64.79,29.2 67.19,29.2 68.09,30.1 79.75,30.1 U$1.P$27
N$65  (via drill 0.3 pad 0.9)
  Top 0.254: R23.2 24.48,15.89 v25.24,16.65 | v73.24,24.8 73.69,24.8 74.24,25.35 74.24,27.15 73.99,27.4 U$1.P$16
  Bottom 0.254: v25.24,16.65 56.14,16.65 56.39,16.4 70.09,16.4 70.09,16.45 73.24,19.6 v73.24,24.8
N$68  (via drill 0.3 pad 0.9)
  Top 0.254: R25.2 19.8,15.36 22.59,18.15 40.84,18.15 45.39,22.7 55.64,22.7 v60.44,27.5 | v74.69,24.8 74.69,27.2 74.49,27.4 U$1.P$17
  Bottom 0.254: v74.69,24.8 73.99,25.5 71.84,25.5 69.84,27.5 v60.44,27.5
N$71
  Top 0.254: R27.2 100.72,15.22 86.69,29.25 75.24,29.25 74.99,29 U$1.P$18
N$73
  Top 0.254: U$1.P$19 75.48,28.59 75.69,28.8 86.44,28.8 97.04,18.2 R29.2
N$78
  Top 0.254: U$1.P$24 77.98,16.24 R22.1
N$79
  Top 0.254: R19.1 92.08,15.86 79.87,28.07 U$1.P$25
N$86
  Top 0.254: R34.2 29.51,15.57 30.39,16.45 41.89,16.45 46.14,20.7 57.24,20.7 65.29,28.75 69.39,28.75 69.49,28.65 U$1.P$7
N$87  (via drill 0.3 pad 0.9)
  Top 0.254: v63.34,25.7 57.04,19.4 45.64,19.4 41.54,15.3 R33.2 | v69.99,26.3 U$1.P$8
  Bottom 0.254: v63.34,25.7 68.39,25.7 68.99,26.3 v69.99,26.3
N$88  (via drill 0.3 pad 0.9)
  Top 0.254: R32.2 46.66,15.32 49.69,18.35 57.99,18.35 v64.64,25 | v69.29,25.4 69.29,25.8 68.99,26.1 U$1.P$6
  Bottom 0.254: v64.64,25 68.89,25 v69.29,25.4
N$89  (via drill 0.3 pad 0.9)
  Top 0.254: R30.2 52.51,15.32 55.04,17.85 58.49,17.85 62.94,22.3 v63.79,22.3 | U$1.P$5 68.49,25.05 v69.24,24.3
  Bottom 0.254: v63.79,22.3 68.49,22.3 69.24,23.05 v69.24,24.3
N$90
  Top 0.254: 54.54,14.9 R28.2 55.24,15.25 55.74,14.75 55.74,8.45 56.59,7.6 67.64,7.6 68.54,8.5 68.54,11.35 66.59,13.3 66.59,23.85 67.99,25.25 U$1.P$4
N$92
  Top 0.254: R24.2 64.56,23.62 66.99,26.05 U$1.P$2
N$93  (via drill 0.3 pad 0.9)
  Top 0.254: v65.64,26.55 65.64,27.23 U$1.P$1 | R31.2 69.55,20.74 v67.24,23.05
  Bottom 0.254: v65.64,26.55 63.09,26.55 62.14,25.6 62.14,23.85 62.94,23.05 v67.24,23.05
N$114  (via drill 0.3 pad 0.9)
  Top 0.254: C11.1 57.44,59.5 v58.99,57.95 58.89,57.95 C9.1 | U4.14 70.69,61.52 68.96,61.52 67.24,59.8 v67.24,57.95 | L1.1 57.83,72.39 v56.99,71.55
  Bottom 0.254: v67.24,57.95 v58.99,57.95 56.79,57.95 56.39,58.35 56.39,71 56.94,71.55 v56.99,71.55
N$133  (via drill 0.3 pad 0.9)
  Top 0.254: C14.1 C13.1 87.49,79.35 91.64,75.2 92.34,75.2 92.79,75.65 92.79,76.35 90.84,78.3 90.84,79.25 91.09,79.5 98.94,79.5 | 98.94,79.5 104.72,79.5 L2.1 | v94.24,43.75 93.04,43.75 v92.44,44.35 | v92.44,52.4 92.44,58.85 91.19,60.1 v91.19,62.2 | v97.89,77.5 97.89,78.45 98.94,79.5 | U6.14 94.39,40.6 v94.14,40.35
  Bottom 0.254: v94.14,40.35 94.14,43.65 v94.24,43.75 | v92.44,44.35 v92.44,52.4 | v91.19,62.2 91.19,65.65 96.39,70.85 96.39,76 v97.89,77.5
RST  (via drill 0.3 pad 0.9)
  Top 0.254: U$1.P$98 64.56,30.57 63.74,29.75 59.74,29.75 v59.29,30.2 | v44.19,30.2 44.14,30.2 41.19,33.15 IC1.2
  Bottom 0.254: v59.29,30.2 v44.19,30.2
RXD  (via drill 0.3 pad 0.9)
  Top 0.254: U$1.P$22 76.98,27.39 76.59,27 76.59,19.45 70.89,13.75 70.89,7.8 70.04,6.95 44.29,6.95 42.84,8.4 42.84,15.55 45.04,17.75 v45.39,17.75 | v39.24,37.05 39.24,35.1 IC1.5
  Bottom 0.254: v45.39,17.75 45.39,27.45 39.24,33.6 v39.24,37.05
TXD  (via drill 0.3 pad 0.9)
  Top 0.254: U$1.P$23 77.48,26.79 v77.29,26.6 | v61.99,32.95 61.14,32.95 60.49,33.6 43.31,33.6 IC1.1
  Bottom 0.254: v77.29,26.6 77.29,26.65 71.74,32.2 64.04,32.2 63.29,32.95 v61.99,32.95
VBAT  (via drill 0.3 pad 0.9)
  Top 0.254: v57.29,66.95 v57.28,66.96 R49.2 57.87,68.78 v58.69,69.6 | C18.1 v57.29,64.75 54.64,64.75 53.94,65.45 45.99,65.45 45.74,65.2 44.29,65.2 U2.28 44.27,66.38 v44.69,66.8 | C18.1 57.29,63.65 | C15.+ R3.2 35.1,50.59 28.44,57.25 28.44,61.58 | 28.44,61.58 C4.1 | 28.44,61.58 28.44,63.25 v28.29,63.4 | U1.24 50.97,89.78 51.84,88.9 v55.34,88.9 62.44,88.9 62.74,89.2 70.79,89.2 71.39,89.8 73.39,89.8 U3.24 | U4.28 78.78,69.99 v79.34,70.55 | C21.+ 56,49.01 60.29,53.3 60.29,62.25 59.39,63.15 C18.1 | v87.19,69.2 87.19,57.7 C23.+ 88.49,56.4 88.49,54.35 | U5.24 111.22,73.53 v111.54,73.2 | v110.54,59.8 110.54,50.1 109.49,49.05 103.35,49.05 | 103.35,49.05 U6.28 | 103.35,49.05 103.35,53.11 v103.39,53.15 | v90.59,53.2 C20.1 88.49,54.35 | R52.2 80.63,52.71 81.54,51.8 83.29,51.8 v83.59,52.1 | v86.39,54.9 87.94,54.9 88.49,54.35
  Bottom 0.254: v57.29,66.95 v57.29,64.75 | v44.69,66.8 43.79,65.9 37.79,65.9 36.54,67.15 28.84,67.15 28.29,66.6 v28.29,63.4 | v58.69,69.6 58.69,71.15 | 58.69,71.15 58.69,74.15 56.39,76.45 56.39,87.85 v55.34,88.9 | v79.34,70.55 78.74,69.95 | 78.74,69.95 76.19,69.95 74.29,71.85 67.79,71.85 67.54,71.6 59.14,71.6 58.69,71.15 | 78.74,69.95 78.79,69.95 79.54,69.2 v87.19,69.2 | v111.54,73.2 111.54,62.75 110.54,61.75 v110.54,59.8 | v103.39,53.15 90.64,53.15 v90.59,53.2 | v83.59,52.1 v86.39,54.9
VCC
  Top 0.254: R4.1 R5.1 20.12,23.54 | 20.12,23.54 X2.1 | 20.12,23.54 20.12,23.53 18.19,21.6 14.84,21.6 12.44,24 12.44,30.75 16.69,35 21.43,35 C10.+ 21.49,37 24.94,40.45 L3.1
X-1  (via drill 0.3 pad 0.9)
  Top 0.254: v58.24,91.65 62.99,91.65 64.09,90.55 64.09,89.85 U3.1 64.04,89.8 v60.79,89.8 | U4.17 75.84,62.85 v71.74,58.75 | v64.49,69.25 64.49,70.7 v60.09,75.1
  Bottom 0.254: X.1 7.72,48.12 6.19,49.65 6.19,89.35 8.49,91.65 v58.24,91.65 | v71.74,58.75 69.54,58.75 67.29,61 67.29,63.95 64.79,66.45 64.79,68.95 v64.49,69.25 | v60.79,89.8 59.59,88.6 59.59,80.9 58.84,80.15 58.84,76.35 v60.09,75.1
X-2  (via drill 0.3 pad 0.9)
  Top 0.254: v112.39,72.25 U5.23 | U6.26 110.18,47.74 111.99,49.55 111.99,59.7 v111.89,59.8
  Top 0.406: U5.23
  Bottom 0.254: X.2 7.87,50.87 7.09,51.65 7.09,88.25 9.54,90.7 60.59,90.7 61.54,91.65 61.54,91.75 62.79,93 106.74,93 112.39,87.35 v112.39,72.25 112.39,62.65 111.89,62.15 v111.89,59.8
X-3  (via drill 0.3 pad 0.9)
  Top 0.254: U2.26 47.08,63.89 v47.59,64.4 | v47.59,71.45 v47.59,80 | U1.23 47.14,88.5 v47.59,88.05
  Bottom 0.254: v47.59,64.4 v47.59,71.45 | v47.59,80 v47.59,88.05 47.14,88.5 16.49,88.5 13.09,85.1 9.09,85.1 7.89,83.9 7.89,54.05 8.32,53.62 X.3
X-4  (via drill 0.3 pad 0.9)
  Top 0.254: U2.24 47.89,62.6 48.74,63.45 v48.74,64.4 | v44.59,72.7 44.59,74.15 v44.47,74.28 43.64,75.1 43.64,76.55 44.14,77.05 45.04,77.05 U1.14
  Bottom 0.254: v48.74,64.4 48.74,71.8 47.84,72.7 v44.59,72.7 | v44.47,74.28 44.09,74.65 27.59,74.65 23.87,70.93 22.94,70 9.6,56.66 X.4
X-5  (via drill 0.3 pad 0.9)
  Top 0.254: U2.23 48.17,61.93 v49.69,63.45 | v35.69,73.5 35.69,75.78 U1.12 | X.5 17.96,59.12 v23.59,64.75
  Bottom 0.254: v49.69,63.45 49.69,72.65 48.84,73.5 v35.69,73.5 32.34,73.5 v23.59,64.75
X-6  (via drill 0.3 pad 0.9)
  Top 0.254: U2.20 40.69,60 39.79,60.9 v39.79,66.8 | 35.74,77.05 U1.11 | v33.74,77.1 35.69,77.1 U1.11 | v39.79,70.75 38.24,72.3 38.24,76.1 37.34,77 35.79,77 U1.11
  Bottom 0.254: v39.79,66.8 v39.79,70.75 | X.6 12.36,61.87 27.59,77.1 v33.74,77.1
X-7  (via drill 0.3 pad 0.9)
  Top 0.254: U2.19 49.63,59.34 50.54,60.25 v50.54,64.4 | U1.2 33.29,88.5 32.79,89 v32.79,89.2 32.79,91 29.99,93.8 22.99,93.8 21.74,92.55 21.74,82.05 19.79,80.1 15.59,80.1 14.64,79.15 14.64,67.5 11.76,64.62 X.7
  Bottom 0.254: v50.54,64.4 50.54,88 49.34,89.2 v32.79,89.2
X-8  (via drill 0.3 pad 0.9)
  Top 0.254: U2.17 51.34,58.05 52.14,58.85 v52.14,64.35 | v52.14,89.75 51.19,90.7 36.64,90.7 | 36.64,90.7 U1.1 | X.8 11.76,67.37 13.74,69.35 13.74,79.5 15.09,80.85 19.29,80.85 20.99,82.55 20.99,93.15 22.44,94.6 34.39,94.6 36.64,92.35 36.64,90.7
  Bottom 0.254: v52.14,64.35 v52.14,89.75
X-9  (via drill 0.3 pad 0.9)
  Top 0.254: v17.09,87.4 v17.09,93.8 | U5.14 104.27,60.85 v113.84,60.85 113.94,60.75 113.94,48.9 111.49,46.45 U6.24
  Bottom 0.254: X.9 9.6,70.14 8.74,71 8.74,79.05 v17.09,87.4 | v17.09,93.8 107.79,93.8 113.84,87.75 v113.84,60.85
X-10  (via drill 0.3 pad 0.9)
  Top 0.254: U2.15 50.69,56.75 v53.29,54.15 | v69.59,55.4 77.29,55.4 77.94,56.05 77.94,61.54 U4.15 v86.14,61.55 | v46.74,84.1 46.04,83.4 45.09,83.4 U1.19 46.12,83.43 46.39,83.15 61.69,83.15 62.64,84.1 72.79,84.1 U3.19 73.39,83.45 77.64,83.45 v79.99,85.8 | v110.59,67.15 104.27,67.15 U5.19 104.22,67.15 99.89,67.15 99.19,66.45 99.19,41.05 99.64,40.6 U6.15
  Bottom 0.254: v53.29,54.15 68.34,54.15 v69.59,55.4 | X.10 19.96,72.87 30.49,83.4 46.04,83.4 v46.74,84.1 | v79.99,85.8 79.99,85.85 84.84,90.7 106.04,90.7 107.49,89.25 | 107.49,89.25 110.59,86.15 v110.59,67.15 | 107.49,89.25 92.99,74.75 92.99,68.45 90.44,65.9 90.44,62.1 89.89,61.55 v86.14,61.55
Y-1
  Top 0.254: Y1.1 17.03,13.62 R21.1
Y-2
  Top 0.254: Y1.2 R20.1
Y-3
  Top 0.254: Y1.3 27.03,13.64 R16.2
Y-4
  Top 0.254: Y1.4 32.03,13.68 R18.2
Y-9  (via drill 0.3 pad 0.9)
  Top 0.254: U$1.P$69 69.48,43.86 69.14,44.2 69.14,45.35 v69.44,45.65 | Y1.9 v57.03,17.09 v57.04,17.1
  Bottom 0.254: v57.04,17.1 57.04,28.75 57.39,29.1 59.59,29.1 60.24,29.75 60.24,36.1 61.09,36.95 66.64,36.95 69.14,39.45 69.14,45.35 v69.44,45.65
Y-13
  Top 0.254: Y1.13 R22.2
Y-16
  Top 0.254: Y1.16 92.03,13.51 R19.2
Y-17
  Top 0.254: Y1.17 97.03,13.49 R29.1
Y-18
  Top 0.254: Y1.18 102.03,13.49 R27.1
Y-19
  Top 0.254: Y1.19 R25.1
Y-20
  Top 0.254: Y1.20 24.53,13.65 R23.1
Y-21
  Top 0.254: Y1.21 29.53,13.64 R34.1
Y-23
  Top 0.254: Y1.23 39.53,13.57 R33.1
Y-24
  Top 0.254: Y1.24 R32.1
Y-25
  Top 0.254: Y1.25 49.53,13.57 R30.1
Y-26
  Top 0.254: Y1.26 R28.1
Y-27
  Top 0.254: Y1.27 59.53,13.57 R26.1
Y-28
  Top 0.254: Y1.28 64.53,13.53 R24.1
Y-29
  Top 0.254: Y1.29 69.53,13.55 R31.1
Y-30
  Top 0.254: Y1.30 74.53,13.55 R7.1
Y-31
  Top 0.254: Y1.31 79.53,13.53 R6.1
Y-32
  Top 0.254: Y1.32 84.53,13.54 R53.1
Y-33
  Top 0.254: Y1.33 89.53,13.53 R8.1
Y-35  (via drill 0.3 pad 0.9)
  Top 0.254: Y1.35 99.53,15.26 v97.84,16.95 | U$1.P$70 68.98,43.71 68.59,44.1 68.59,45.1 v67.39,46.3
  Bottom 0.254: v97.84,16.95 92.14,16.95 80.44,28.65 80.44,39.25 71.59,48.1 69.19,48.1 v67.39,46.3
Z-1  (via drill 0.3 pad 0.9)
  Top 0.254: U6.23 102.45,45.78 102.04,46.2 102.04,53.25 102.79,54 102.79,55.1 | 102.79,55.1 v102.79,57.8 | v92.99,60.8 94.24,59.55 U5.12 | X3.1 116.98,52.46 v115.79,53.65 | v109.39,53.65 104.24,53.65 102.79,55.1
  Bottom 0.254: v102.79,57.8 102.79,58.1 101.34,59.55 94.24,59.55 v92.99,60.8 | v115.79,53.65 v109.39,53.65
Z-2  (via drill 0.3 pad 0.9)
  Top 0.254: v97.04,57.75 97.04,60.2 96.44,60.8 94.92,60.8 U5.11 | U6.20 100.64,43.85 100.04,44.45 v100.04,55.3 100.04,55.45 v100.04,57.75 | X3.2 116.23,54.96 v115.79,55.4
  Bottom 0.254: v100.04,57.75 v97.04,57.75 | v115.79,55.4 100.14,55.4 v100.04,55.3
Z-3  (via drill 0.3 pad 0.9)
  Top 0.254: U3.23 75.55,88.56 v76.24,89.25 | U4.26 78.08,68.85 81.69,68.85 82.09,69.25 v82.09,70 | v111.14,92.45 105.89,92.45 v105.74,92.3 | v76.29,92.1 v75.04,90.85
  Bottom 0.254: v82.09,70 82.09,70.1 76.24,75.95 76.24,77 76.84,77.6 76.84,88.7 76.29,89.25 v76.24,89.25 75.04,90.45 v75.04,90.85 | X3.3 117.9,57.71 119.54,59.35 119.54,89.8 116.89,92.45 v111.14,92.45 | v105.74,92.3 76.49,92.3 v76.29,92.1
Z-4  (via drill 0.3 pad 0.9)
  Top 0.254: U3.14 77.84,77.12 | 77.84,77.12 88.61,77.12 91.14,74.6 111.89,74.6 113.29,73.2 113.29,62.1 v113.04,61.85 | v78.39,74.95 78.39,76.58 77.84,77.12 | U4.24 78.07,67.25 80.24,67.25 81.29,68.3 82.24,68.3 83.29,69.35 83.29,69.95 v83.34,70
  Bottom 0.254: X3.4 116.98,59.8 113.49,59.8 113.04,60.25 v113.04,61.85 | v83.34,70 83.34,70.5 78.89,74.95 v78.39,74.95
Z-5  (via drill 0.3 pad 0.9)
  Top 0.254: v81.79,67.5 81.03,66.73 U4.23 77.91,66.75 76.44,66.75 76.14,67.05 76.14,70.1 76.94,70.9 v77.84,70.9 | v91.64,78.7 94.54,75.8 111.84,75.8 114.14,73.5 114.14,65.45 v114.64,64.95 | U3.12 66.08,75.86 67.34,74.6 v67.34,72.45
  Bottom 0.254: v81.79,67.5 82.94,68.65 83.89,68.65 84.39,68.15 89.54,68.15 90.44,69.05 90.44,77.5 v91.64,78.7 | v114.64,64.95 116.39,63.2 X3.5 | v67.34,72.45 76.64,72.45 77.84,71.25 v77.84,70.9
Z-6  (via drill 0.3 pad 0.9)
  Top 0.254: v57.14,89.75 57.14,92.4 57.74,93 103.74,93 105.59,91.15 | 105.59,91.15 v115.14,81.6 | U4.20 82.55,64.81 v83.39,65.65 | v103.89,89.45 105.59,91.15 | v58.74,81.35 58.74,80.45 59.29,79.9 59.29,77.65 59.81,77.12 U3.11
  Bottom 0.254: v58.74,81.35 58.74,88.15 v57.14,89.75 | v115.14,81.6 115.14,66.8 115.99,65.95 X3.6 | v103.89,89.45 91.09,76.65 91.09,68.75 87.99,65.65 v83.39,65.65
Z-8  (via drill 0.3 pad 0.9)
  Top 0.254: U3.2 71.2,88.56 71.84,89.2 74.94,89.2 76.44,90.7 89.04,90.7 | 89.04,90.7 101.29,90.7 116.29,75.7 116.29,72.81 X3.8 | U4.19 82.98,64.14 v83.39,64.55 | v91.99,76.1 90.29,77.8 90.29,89.45 89.04,90.7
  Bottom 0.254: v91.99,76.1 91.99,68.45 88.44,64.9 84.34,64.9 83.99,64.55 v83.39,64.55
Z-11  (via drill 0.3 pad 0.9)
  Top 0.254: v98.34,20 C3.+ 103.38,22.69 IC3.2 103.57,25.13 v103.59,25.15 | 54.79,53.45 54.79,52.25 53.13,50.59 D3.C R3.1 37.31,51.95 35.04,51.95 v30.84,56.15 | 54.79,53.45 54.79,54.1 53.84,55.05 v53.84,64.35 | v55.59,66.95 R49.1 | X.11 X.12 9.6,78.36 14.59,83.35 17.15,83.35 C2.+ 19.62,83.37 v19.64,83.35 | v26.69,81.95 28.08,81.95 IC2.2 28.58,81.91 29.04,81.45 v29.04,66 | v69.24,52.4 74.19,52.4 76.09,54.3 81.69,54.3 82.33,53.66 R52.1 82.3,53.2 v83.54,53.2 | v55.79,53 55.24,53 54.79,53.45
  Bottom 0.254: Y1.34 94.88,9.09 98.59,12.8 98.59,19.75 v98.34,20 | v53.84,64.35 53.84,65.2 v55.59,66.95 | v19.64,83.35 25.29,83.35 v26.69,81.95 | v29.04,66 29.04,57.95 v30.84,56.15 | v69.24,52.4 56.39,52.4 v55.79,53 | X3.11 118.18,79.71 118.69,79.2 118.69,69.76 X3.7 117.68,68.71 118.69,67.7 118.69,59.85 117.69,58.85 117.49,58.85 | 117.49,58.85 107.54,58.85 104.69,56 84.44,56 83.89,55.45 83.89,53.55 v83.54,53.2 | v103.59,25.15 103.59,25.2 110.79,32.4 110.79,42.1 116.69,48 116.69,58.05 117.49,58.85
(copper drawn outside any net)
  shapes: Bottom area x1, Top area x2

## Text on the board
Top: Created by / B.Kościelniak / D.Ksyta